# EAGLE schematic zed_fmc (EAGLE 6.2)
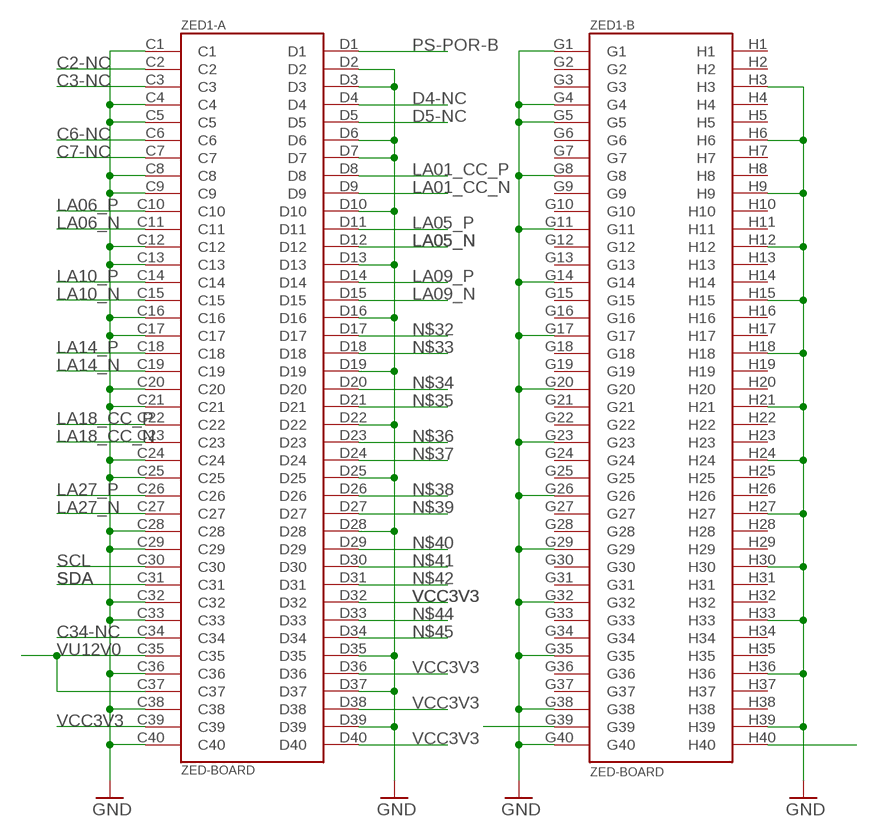
[diagram p0: schematic, sheet 1]

## Parts
ZED1  ZED-BOARD  [ASP-134604-01]

## Nets
C2-NC: ZED1.C2(-A:C2)
C3-NC: ZED1.C3(-A:C3)
C6-NC: ZED1.C6(-A:C6)
C7-NC: ZED1.C7(-A:C7)
C34-NC: ZED1.C34(-A:C34)
D4-NC: ZED1.D4(-A:D4)
D5-NC: ZED1.D5(-A:D5)
GND: ZED1.C1(-A:C1) ZED1.C4(-A:C4) ZED1.C5(-A:C5) ZED1.C8(-A:C8) ZED1.C9(-A:C9) ZED1.C12(-A:C12) ZED1.C13(-A:C13) ZED1.C16(-A:C16) ZED1.C17(-A:C17) ZED1.C20(-A:C20) ZED1.C21(-A:C21) ZED1.C24(-A:C24) ZED1.C25(-A:C25) ZED1.C28(-A:C28) ZED1.C29(-A:C29) ZED1.C32(-A:C32) ZED1.C33(-A:C33) ZED1.C36(-A:C36) ZED1.C38(-A:C38) ZED1.C40(-A:C40) ZED1.D2(-A:D2) ZED1.D3(-A:D3) ZED1.D6(-A:D6) ZED1.D7(-A:D7) ZED1.D10(-A:D10) ZED1.D13(-A:D13) ZED1.D16(-A:D16) ZED1.D19(-A:D19) ZED1.D22(-A:D22) ZED1.D25(-A:D25) ZED1.D28(-A:D28) ZED1.D35(-A:D35) ZED1.D37(-A:D37) ZED1.D39(-A:D39) ZED1.G1(-B:G1) ZED1.G4(-B:G4) ZED1.G5(-B:G5) ZED1.G8(-B:G8) ZED1.G11(-B:G11) ZED1.G14(-B:G14) ZED1.G17(-B:G17) ZED1.G20(-B:G20) ZED1.G23(-B:G23) ZED1.G26(-B:G26) ZED1.G29(-B:G29) ZED1.G32(-B:G32) ZED1.G35(-B:G35) ZED1.G38(-B:G38) ZED1.G40(-B:G40) ZED1.H3(-B:H3) ZED1.H6(-B:H6) ZED1.H9(-B:H9) ZED1.H12(-B:H12) ZED1.H15(-B:H15) ZED1.H18(-B:H18) ZED1.H21(-B:H21) ZED1.H24(-B:H24) ZED1.H27(-B:H27) ZED1.H30(-B:H30) ZED1.H33(-B:H33) ZED1.H36(-B:H36) ZED1.H39(-B:H39)
LA01_CC_N: ZED1.D9(-A:D9)
LA01_CC_P: ZED1.D8(-A:D8)
LA05_N: ZED1.D12(-A:D12)
LA05_P: ZED1.D11(-A:D11)
LA06_N: ZED1.C11(-A:C11)
LA06_P: ZED1.C10(-A:C10)
LA09_N: ZED1.D15(-A:D15)
LA09_P: ZED1.D14(-A:D14)
LA10_N: ZED1.C15(-A:C15)
LA10_P: ZED1.C14(-A:C14)
LA14_N: ZED1.C19(-A:C19)
LA14_P: ZED1.C18(-A:C18)
LA18_CC_N: ZED1.C23(-A:C23)
LA18_CC_P: ZED1.C22(-A:C22)
LA27_N: ZED1.C27(-A:C27)
LA27_P: ZED1.C26(-A:C26)
N$1: ZED1.G39(-B:G39)
N$2: ZED1.H40(-B:H40)
N$32: ZED1.D17(-A:D17)
N$33: ZED1.D18(-A:D18)
N$34: ZED1.D20(-A:D20)
N$35: ZED1.D21(-A:D21)
N$36: ZED1.D23(-A:D23)
N$37: ZED1.D24(-A:D24)
N$38: ZED1.D26(-A:D26)
N$39: ZED1.D27(-A:D27)
N$40: ZED1.D29(-A:D29)
N$41: ZED1.D30(-A:D30)
N$42: ZED1.D31(-A:D31)
N$44: ZED1.D33(-A:D33)
N$45: ZED1.D34(-A:D34)
PS-POR-B: ZED1.D1(-A:D1)
SCL: ZED1.C30(-A:C30)
SDA: ZED1.C31(-A:C31)
VCC3V3: ZED1.C39(-A:C39) ZED1.D32(-A:D32) ZED1.D36(-A:D36) ZED1.D38(-A:D38) ZED1.D40(-A:D40)
VU12V0: ZED1.C35(-A:C35) ZED1.C37(-A:C37)
Unconnected: ZED1.G2(-B:G2) ZED1.G3(-B:G3) ZED1.G6(-B:G6) ZED1.G7(-B:G7) ZED1.G9(-B:G9) ZED1.G10(-B:G10) ZED1.G12(-B:G12) ZED1.G13(-B:G13) ZED1.G15(-B:G15) ZED1.G16(-B:G16) ZED1.G18(-B:G18) ZED1.G19(-B:G19) ZED1.G21(-B:G21) ZED1.G22(-B:G22) ZED1.G24(-B:G24) ZED1.G25(-B:G25) ZED1.G27(-B:G27) ZED1.G28(-B:G28) ZED1.G30(-B:G30) ZED1.G31(-B:G31) ZED1.G33(-B:G33) ZED1.G34(-B:G34) ZED1.G36(-B:G36) ZED1.G37(-B:G37) ZED1.H1(-B:H1) ZED1.H2(-B:H2) ZED1.H4(-B:H4) ZED1.H5(-B:H5) ZED1.H7(-B:H7) ZED1.H8(-B:H8) ZED1.H10(-B:H10) ZED1.H11(-B:H11) ZED1.H13(-B:H13) ZED1.H14(-B:H14) ZED1.H16(-B:H16) ZED1.H17(-B:H17) ZED1.H19(-B:H19) ZED1.H20(-B:H20) ZED1.H22(-B:H22) ZED1.H23(-B:H23) ZED1.H25(-B:H25) ZED1.H26(-B:H26) ZED1.H28(-B:H28) ZED1.H29(-B:H29) ZED1.H31(-B:H31) ZED1.H32(-B:H32) ZED1.H34(-B:H34) ZED1.H35(-B:H35) ZED1.H37(-B:H37) ZED1.H38(-B:H38)

## Library data of the parts
ZED1 = zed-board:ZED-BOARD